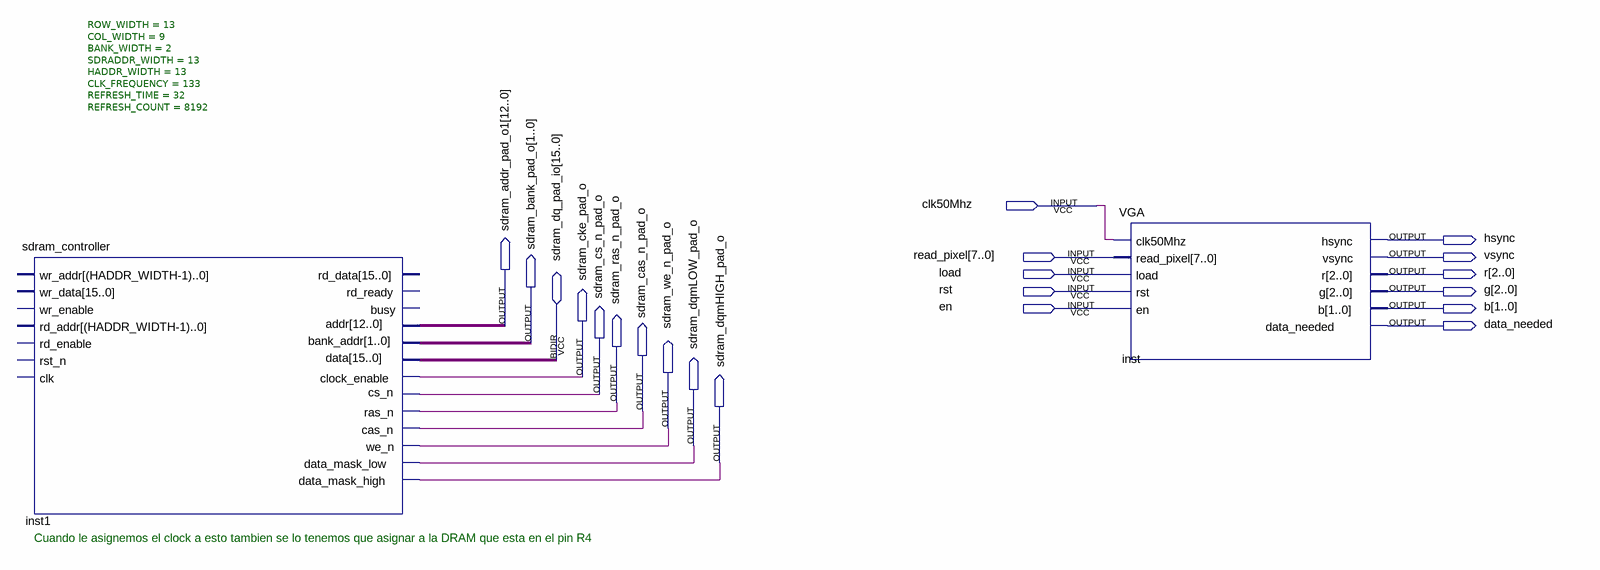
[diagram p0: schematic sheet]
// Quartus schematic TP2_EV_RISCV.bdf as structural Verilog: 2 symbols, 21 pins
module TP2_EV_RISCV (
  input  clk50Mhz,
  input  [7:0] read_pixel,
  input  load,
  input  rst,
  input  en,
  inout  [15:0] sdram_dq_pad_io,
  output hsync,
  output vsync,
  output [2:0] r,
  output [2:0] g,
  output [1:0] b,
  output [12:0] sdram_addr_pad_o1,
  output data_needed,
  output [1:0] sdram_bank_pad_o,
  output sdram_cke_pad_o,
  output sdram_cs_n_pad_o,
  output sdram_ras_n_pad_o,
  output sdram_cas_n_pad_o,
  output sdram_we_n_pad_o,
  output sdram_dqmLOW_pad_o,
  output sdram_dqmHIGH_pad_o
);

  sdram_controller #(.ROW_WIDTH(13), .COL_WIDTH(9), .BANK_WIDTH(2), .SDRADDR_WIDTH(13), .HADDR_WIDTH(13), .CLK_FREQUENCY(133), .REFRESH_TIME(32), .REFRESH_COUNT(8192)) inst1 (
    .clock_enable(sdram_cke_pad_o), .cs_n(sdram_cs_n_pad_o), .ras_n(sdram_ras_n_pad_o),
    .cas_n(sdram_cas_n_pad_o), .we_n(sdram_we_n_pad_o), .data_mask_low(sdram_dqmLOW_pad_o),
    .data_mask_high(sdram_dqmHIGH_pad_o), .addr(sdram_addr_pad_o1), .bank_addr(sdram_bank_pad_o),
    .data(sdram_dq_pad_io));  // open: wr_addr, wr_data, wr_enable, rd_addr, rd_enable, rst_n, clk, rd_data, rd_ready, busy
  VGA inst (
    .clk50Mhz(clk50Mhz), .read_pixel(read_pixel), .load(load), .rst(rst), .en(en), .hsync(hsync),
    .vsync(vsync), .r(r), .g(g), .b(b), .data_needed(data_needed));

  // Notes on the sheet:
  //   Cuando le asignemos el clock a esto tambien se lo tenemos que asignar a la DRAM que esta en el pin R4
endmodule
